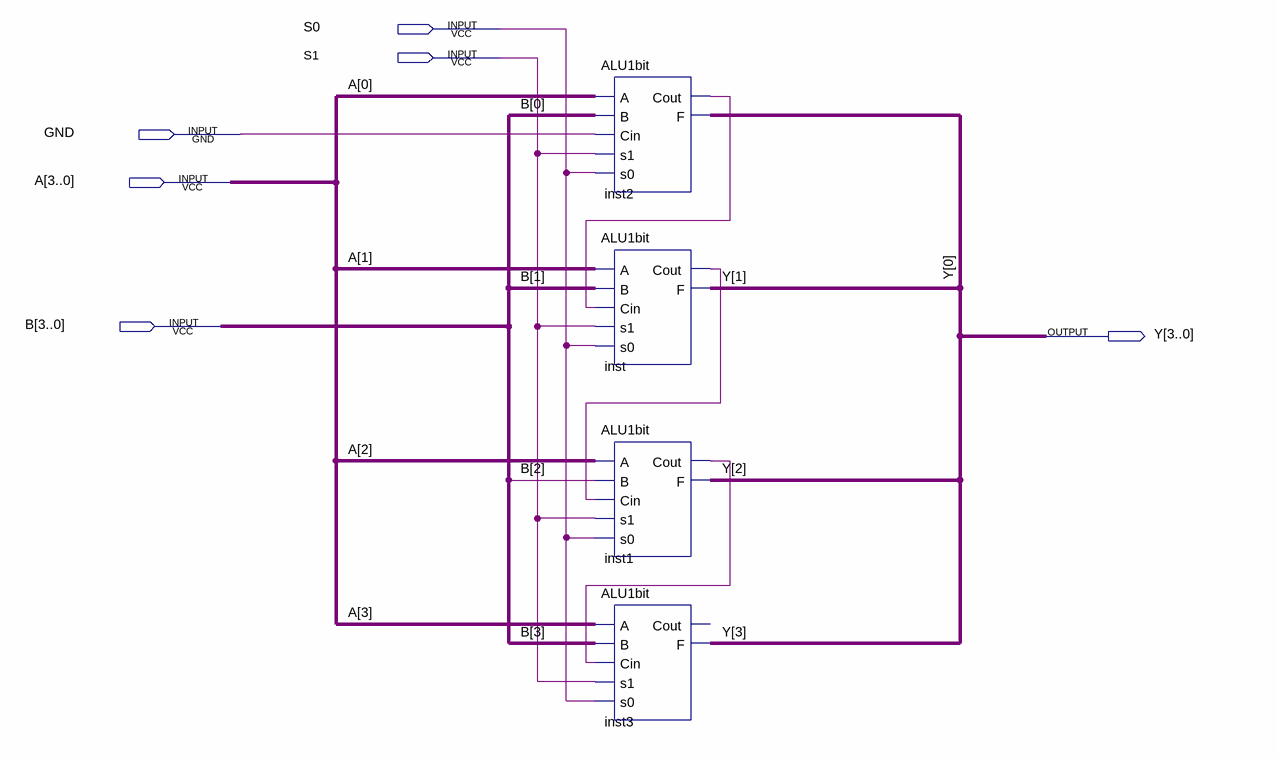
[diagram p0: schematic sheet]
// Quartus schematic ALU4bit.bdf as structural Verilog: 4 symbols, 6 pins
module ALU4bit (
  input  S0,
  input  S1,
  input  GND,
  input  [3:0] A,
  input  [3:0] B,
  output [3:0] Y
);

  wire inst1_cout, inst2_cout, inst_cout;

  ALU1bit inst2 (.A(A[0]), .B(B[0]), .Cin(GND), .s1(S1), .s0(S0), .Cout(inst2_cout), .F(Y[0]));
  ALU1bit inst (.A(A[1]), .B(B[1]), .Cin(inst2_cout), .s1(S1), .s0(S0), .Cout(inst_cout), .F(Y[1]));
  ALU1bit inst1 (.A(A[2]), .B(B[2]), .Cin(inst_cout), .s1(S1), .s0(S0), .Cout(inst1_cout), .F(Y[2]));
  ALU1bit inst3 (.A(A[3]), .B(B[3]), .Cin(inst1_cout), .s1(S1), .s0(S0), .F(Y[3]));  // open: Cout
endmodule
